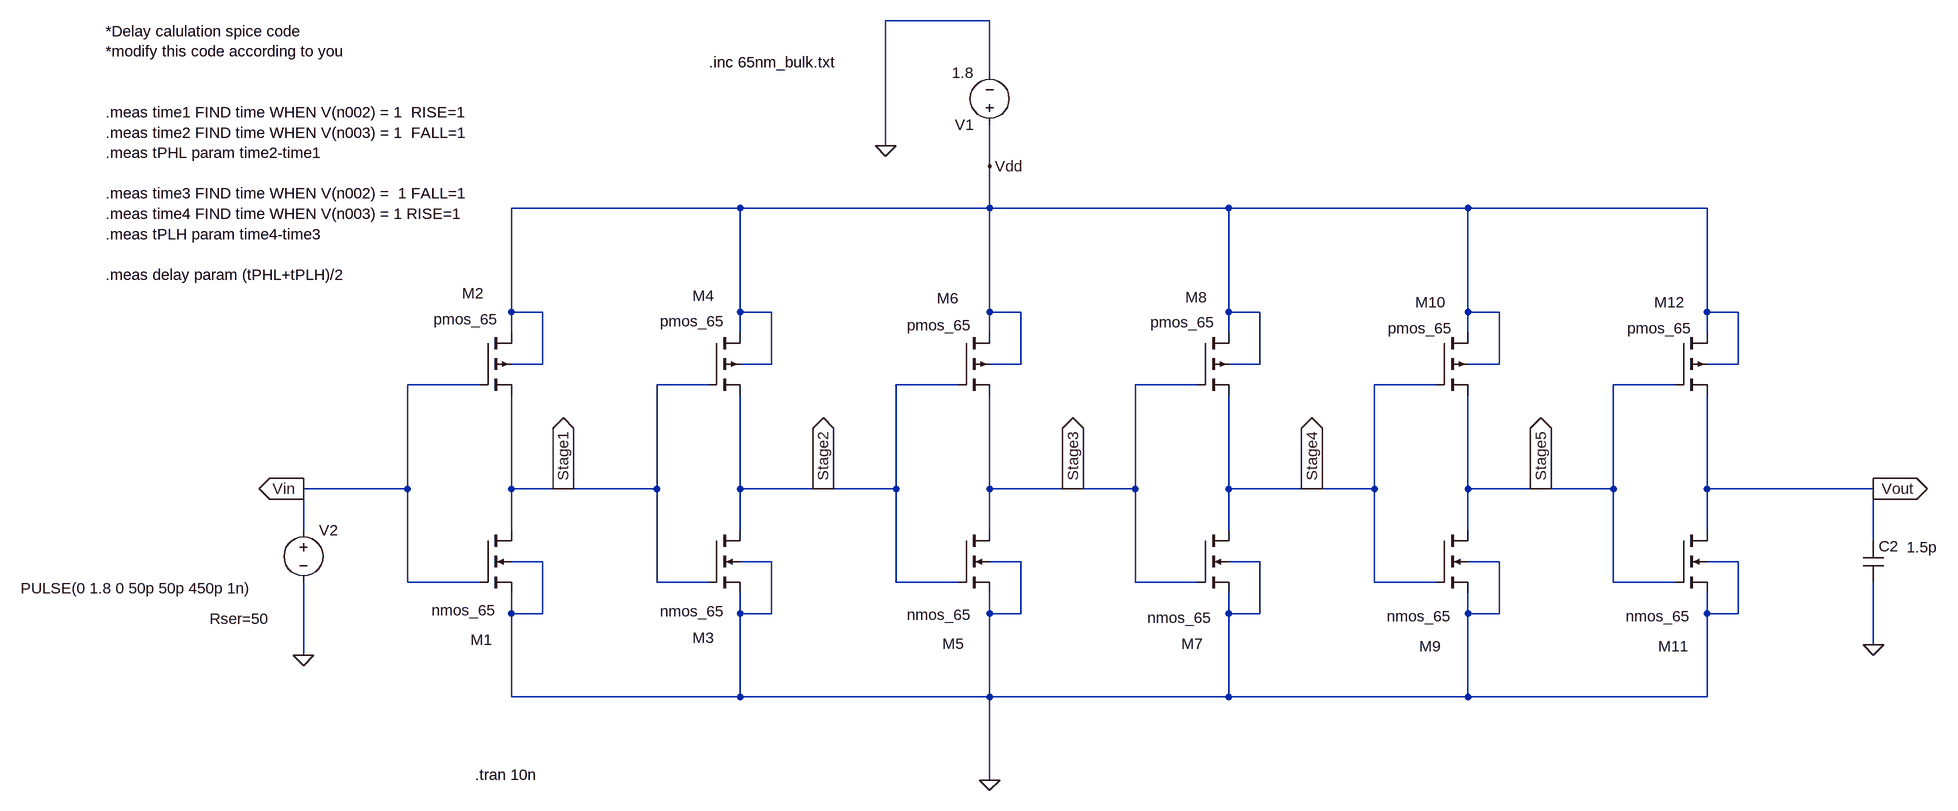
[diagram p0: schematic inverter_chain_buffer_65nm.asc]
inverter_chain_buffer_65nm.asc, the LTspice schematic file:
Version 4.1
SHEET 1 3320 680
WIRE 976 -576 816 -576
WIRE 976 -496 976 -576
WIRE 816 -384 816 -576
WIRE 976 -352 976 -416
WIRE 592 -288 240 -288
WIRE 976 -288 976 -352
WIRE 976 -288 592 -288
WIRE 1344 -288 976 -288
WIRE 1712 -288 1344 -288
WIRE 2080 -288 1712 -288
WIRE 240 -128 240 -288
WIRE 288 -128 240 -128
WIRE 592 -128 592 -288
WIRE 640 -128 592 -128
WIRE 976 -128 976 -288
WIRE 1024 -128 976 -128
WIRE 1344 -128 1344 -288
WIRE 1392 -128 1344 -128
WIRE 1712 -128 1712 -288
WIRE 1760 -128 1712 -128
WIRE 2080 -128 2080 -288
WIRE 2128 -128 2080 -128
WIRE 240 -96 240 -128
WIRE 592 -96 592 -128
WIRE 976 -96 976 -128
WIRE 1344 -96 1344 -128
WIRE 1712 -96 1712 -128
WIRE 2080 -96 2080 -128
WIRE 288 -48 288 -128
WIRE 288 -48 240 -48
WIRE 640 -48 640 -128
WIRE 640 -48 592 -48
WIRE 1024 -48 1024 -128
WIRE 1024 -48 976 -48
WIRE 1392 -48 1392 -128
WIRE 1392 -48 1344 -48
WIRE 1760 -48 1760 -128
WIRE 1760 -48 1712 -48
WIRE 2128 -48 2128 -128
WIRE 2128 -48 2080 -48
WIRE 192 -16 80 -16
WIRE 544 -16 464 -16
WIRE 928 -16 832 -16
WIRE 1296 -16 1200 -16
WIRE 1664 -16 1568 -16
WIRE 2032 -16 1936 -16
WIRE 80 144 80 -16
WIRE 80 144 -80 144
WIRE 240 144 240 0
WIRE 320 144 240 144
WIRE 464 144 464 -16
WIRE 464 144 320 144
WIRE 592 144 592 0
WIRE 720 144 592 144
WIRE 832 144 832 -16
WIRE 832 144 720 144
WIRE 976 144 976 0
WIRE 1104 144 976 144
WIRE 1200 144 1200 -16
WIRE 1200 144 1104 144
WIRE 1344 144 1344 0
WIRE 1472 144 1344 144
WIRE 1568 144 1568 -16
WIRE 1568 144 1472 144
WIRE 1712 144 1712 0
WIRE 1824 144 1712 144
WIRE 1936 144 1936 -16
WIRE 1936 144 1824 144
WIRE 2080 144 2080 0
WIRE 2336 144 2080 144
WIRE -80 208 -80 144
WIRE 240 208 240 144
WIRE 592 208 592 144
WIRE 976 208 976 144
WIRE 1344 208 1344 144
WIRE 1712 208 1712 144
WIRE 2080 208 2080 144
WIRE 2336 224 2336 144
WIRE 288 256 240 256
WIRE 640 256 592 256
WIRE 1024 256 976 256
WIRE 1392 256 1344 256
WIRE 1760 256 1712 256
WIRE 2128 256 2080 256
WIRE 80 288 80 144
WIRE 192 288 80 288
WIRE 464 288 464 144
WIRE 544 288 464 288
WIRE 832 288 832 144
WIRE 928 288 832 288
WIRE 1200 288 1200 144
WIRE 1296 288 1200 288
WIRE 1568 288 1568 144
WIRE 1664 288 1568 288
WIRE 1936 288 1936 144
WIRE 2032 288 1936 288
WIRE 240 336 240 304
WIRE 288 336 288 256
WIRE 288 336 240 336
WIRE 592 336 592 304
WIRE 640 336 640 256
WIRE 640 336 592 336
WIRE 976 336 976 304
WIRE 1024 336 1024 256
WIRE 1024 336 976 336
WIRE 1344 336 1344 304
WIRE 1392 336 1392 256
WIRE 1392 336 1344 336
WIRE 1712 336 1712 304
WIRE 1760 336 1760 256
WIRE 1760 336 1712 336
WIRE 2080 336 2080 304
WIRE 2128 336 2128 256
WIRE 2128 336 2080 336
WIRE 2336 384 2336 288
WIRE -80 400 -80 288
WIRE 240 464 240 336
WIRE 592 464 592 336
WIRE 592 464 240 464
WIRE 976 464 976 336
WIRE 976 464 592 464
WIRE 1344 464 1344 336
WIRE 1344 464 976 464
WIRE 1712 464 1712 336
WIRE 1712 464 1344 464
WIRE 2080 464 2080 336
WIRE 2080 464 1712 464
WIRE 976 592 976 464
FLAG -80 400 0
FLAG 976 592 0
FLAG 816 -384 0
FLAG 2336 384 0
FLAG -80 144 Vin
IOPIN -80 144 Out
FLAG 2336 144 Vout
IOPIN 2336 144 Out
FLAG 320 144 Stage1
IOPIN 320 144 Out
FLAG 720 144 Stage2
IOPIN 720 144 Out
FLAG 1104 144 Stage3
IOPIN 1104 144 Out
FLAG 1472 144 Stage4
IOPIN 1472 144 Out
FLAG 1824 144 Stage5
IOPIN 1824 144 Out
FLAG 976 -352 Vdd
SYMBOL nmos4 192 208 R0
WINDOW 0 -15 168 Left 2
WINDOW 3 -75 123 Left 2
SYMATTR InstName M1
SYMATTR Value nmos_65
SYMATTR Value2 l=65n w=140n
SYMBOL pmos4 192 -96 R0
WINDOW 0 -28 -61 Left 2
WINDOW 3 -72 -21 Left 2
SYMATTR InstName M2
SYMATTR Value pmos_65
SYMATTR Value2 l=65n w=280n
SYMBOL voltage 976 -400 R180
WINDOW 123 0 0 Left 0
WINDOW 39 0 0 Left 0
SYMATTR InstName V1
SYMATTR Value 1.8
SYMBOL voltage -80 192 R0
WINDOW 3 -435 105 Left 2
WINDOW 123 0 0 Left 0
WINDOW 39 -144 152 Left 2
SYMATTR Value PULSE(0 1.8 0 50p 50p 450p 1n)
SYMATTR SpiceLine Rser=50
SYMATTR InstName V2
SYMBOL nmos4 544 208 R0
WINDOW 0 -25 165 Left 2
WINDOW 3 -75 124 Left 2
SYMATTR InstName M3
SYMATTR Value nmos_65
SYMATTR Value2 l=65n w=442.4n
SYMBOL nmos4 928 208 R0
WINDOW 0 -25 174 Left 2
WINDOW 3 -79 130 Left 2
SYMATTR InstName M5
SYMATTR Value nmos_65
SYMATTR Value2 l=65n w=1397.984n
SYMBOL nmos4 1296 208 R0
WINDOW 0 -25 174 Left 2
WINDOW 3 -77 134 Left 2
SYMATTR InstName M7
SYMATTR Value nmos_65
SYMATTR Value2 l=65n w=4417.629n
SYMBOL nmos4 1664 208 R0
WINDOW 0 -27 178 Left 2
WINDOW 3 -77 132 Left 2
SYMATTR InstName M9
SYMATTR Value nmos_65
SYMATTR Value2 l=65n w=13959.709n
SYMBOL pmos4 544 -96 R0
WINDOW 0 -25 -57 Left 2
WINDOW 3 -75 -18 Left 2
SYMATTR InstName M4
SYMATTR Value pmos_65
SYMATTR Value2 l=65n w=884.8n
SYMBOL pmos4 928 -96 R0
WINDOW 0 -33 -53 Left 2
WINDOW 3 -79 -12 Left 2
SYMATTR InstName M6
SYMATTR Value pmos_65
SYMATTR Value2 l=65n w=2795.968n
SYMBOL pmos4 1296 -96 R0
WINDOW 0 -19 -55 Left 2
WINDOW 3 -73 -16 Left 2
SYMATTR InstName M8
SYMATTR Value pmos_65
SYMATTR Value2 l=65n w=8835.2588n
SYMBOL pmos4 1664 -96 R0
WINDOW 0 -33 -47 Left 2
WINDOW 3 -75 -7 Left 2
SYMATTR InstName M10
SYMATTR Value pmos_65
SYMATTR Value2 l=65n w=27919.41n
SYMBOL cap 2320 224 R0
WINDOW 3 67 10 Left 2
SYMATTR Value 1.5p
SYMATTR InstName C2
SYMBOL nmos4 2032 208 R0
WINDOW 0 -27 178 Left 2
WINDOW 3 -77 132 Left 2
SYMATTR InstName M11
SYMATTR Value nmos_65
SYMATTR Value2 l=65n w=44112.6805n
SYMBOL pmos4 2032 -96 R0
WINDOW 0 -33 -47 Left 2
WINDOW 3 -75 -7 Left 2
SYMATTR InstName M12
SYMATTR Value pmos_65
SYMATTR Value2 l=65n w=88225.36107n
TEXT 544 -512 Left 2 !.inc 65nm_bulk.txt
TEXT 184 584 Left 2 !.tran 10n
TEXT -384 -560 Left 2 !*Delay calulation spice code\n*modify this code according to you\n \n\n.meas time1 FIND time WHEN V(n002) = 1  RISE=1\n.meas time2 FIND time WHEN V(n003) = 1  FALL=1\n.meas tPHL param time2-time1\n \n.meas time3 FIND time WHEN V(n002) =  1 FALL=1\n.meas time4 FIND time WHEN V(n003) = 1 RISE=1\n.meas tPLH param time4-time3\n \n.meas delay param (tPHL+tPLH)/2

The netlist it stands for:
* inverter_chain_buffer_65nm.asc
M1 Stage1 Vin 0 0 nmos_65 l=65n w=140n
M2 Vdd Vin Stage1 Vdd pmos_65 l=65n w=280n
V1 Vdd 0 1.8
V2 Vin 0 PULSE(0 1.8 0 50p 50p 450p 1n) Rser=50
M3 Stage2 Stage1 0 0 nmos_65 l=65n w=442.4n
M5 Stage3 Stage2 0 0 nmos_65 l=65n w=1397.984n
M7 Stage4 Stage3 0 0 nmos_65 l=65n w=4417.629n
M9 Stage5 Stage4 0 0 nmos_65 l=65n w=13959.709n
M4 Vdd Stage1 Stage2 Vdd pmos_65 l=65n w=884.8n
M6 Vdd Stage2 Stage3 Vdd pmos_65 l=65n w=2795.968n
M8 Vdd Stage3 Stage4 Vdd pmos_65 l=65n w=8835.2588n
M10 Vdd Stage4 Stage5 Vdd pmos_65 l=65n w=27919.41n
C2 Vout 0 1.5p
M11 Vout Stage5 0 0 nmos_65 l=65n w=44112.6805n
M12 Vdd Stage5 Vout Vdd pmos_65 l=65n w=88225.36107n
.model NMOS NMOS
.model PMOS PMOS
.lib standard.mos
.inc 65nm_bulk.txt
.tran 10n
*Delay calulation spice code
*modify this code according to you
.meas time1 FIND time WHEN V(n002) = 1  RISE=1
.meas time2 FIND time WHEN V(n003) = 1  FALL=1
.meas tPHL param time2-time1
.meas time3 FIND time WHEN V(n002) =  1 FALL=1
.meas time4 FIND time WHEN V(n003) = 1 RISE=1
.meas tPLH param time4-time3
.meas delay param (tPHL+tPLH)/2
.backanno
.end